# Altium schematic sheet [05] CM4_PART2.SchDoc: Compute Module 4 (Part #2)
size B; Engineer: M. Folejewski; DocumentNumber: 5; SheetNumber: 5; SheetTotal: 17; PageSize: B; Designators: 100-199
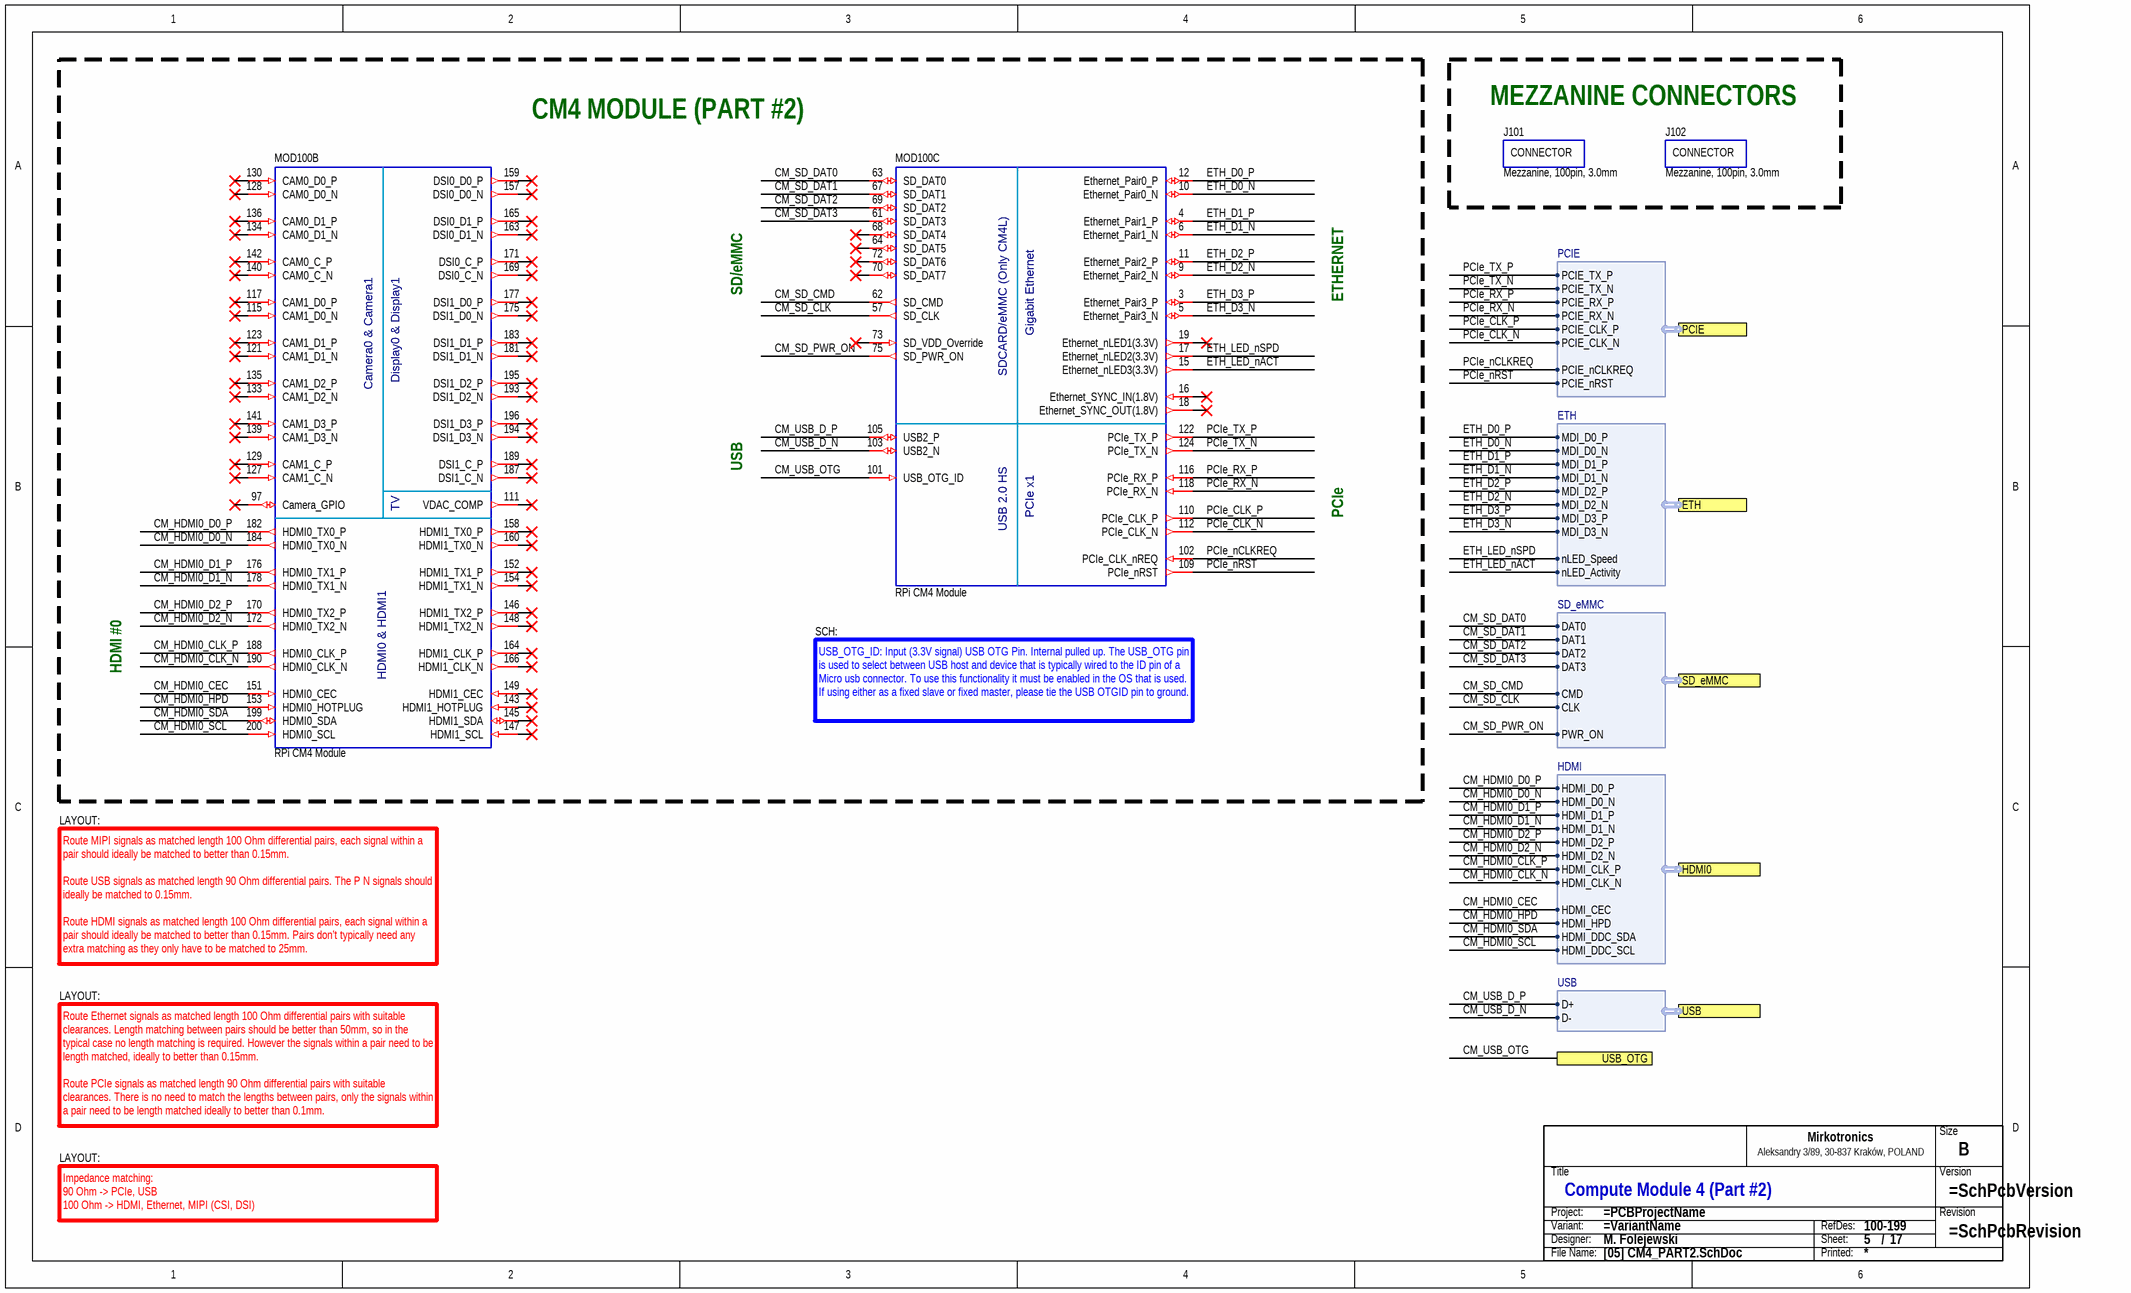
[diagram p0: [05] CM4_PART2.SchDoc]

## Parts
J101  Mezzanine, 100pin, 3.0mm  [PCB_BLANK_COMP_SMD]
J102  Mezzanine, 100pin, 3.0mm  [PCB_BLANK_COMP_SMD]
MOD100  RPi CM4 Module  [MOD_RPI_CM4_SOCKET_P40_C300]  (parts B,C of 4)
TB?  Title block  (value not drawn)  (graphical)

## Ports
ETH (harness ETH), HDMI0 (harness HDMI), PCIE (harness PCIE), SD_eMMC (harness SD_eMMC), USB (harness USB), USB_OTG

## Harnesses
SD_eMMC: DAT0, DAT1, DAT2, DAT3, CMD, CLK, PWR_ON
USB: D+, D-
ETH: MDI_D0_P, MDI_D0_N, MDI_D1_P, MDI_D1_N, MDI_D2_P, MDI_D2_N, MDI_D3_P, MDI_D3_N, nLED_Speed, nLED_Activity
PCIE: PCIE_TX_P, PCIE_TX_N, PCIE_RX_P, PCIE_RX_N, PCIE_CLK_P, PCIE_CLK_N, PCIE_nCLKREQ, PCIE_nRST
HDMI: HDMI_D0_P, HDMI_D0_N, HDMI_D1_P, HDMI_D1_N, HDMI_CEC, HDMI_DDC_SDA, HDMI_D2_P, HDMI_D2_N, HDMI_CLK_P, HDMI_CLK_N, HDMI_DDC_SCL, HDMI_HPD

## Nets
CM_HDMI0_CEC: MOD100.151(HDMI0_CEC) ; port HDMI0.HDMI_CEC
CM_HDMI0_CLK_N: MOD100.190(HDMI0_CLK_N) ; port HDMI0.HDMI_CLK_N
CM_HDMI0_CLK_P: MOD100.188(HDMI0_CLK_P) ; port HDMI0.HDMI_CLK_P
CM_HDMI0_D0_N: MOD100.184(HDMI0_TX0_N) ; port HDMI0.HDMI_D0_N
CM_HDMI0_D0_P: MOD100.182(HDMI0_TX0_P) ; port HDMI0.HDMI_D0_P
CM_HDMI0_D1_N: MOD100.178(HDMI0_TX1_N) ; port HDMI0.HDMI_D1_N
CM_HDMI0_D1_P: MOD100.176(HDMI0_TX1_P) ; port HDMI0.HDMI_D1_P
CM_HDMI0_D2_N: MOD100.172(HDMI0_TX2_N) ; port HDMI0.HDMI_D2_N
CM_HDMI0_D2_P: MOD100.170(HDMI0_TX2_P) ; port HDMI0.HDMI_D2_P
CM_HDMI0_HPD: MOD100.153(HDMI0_HOTPLUG) ; port HDMI0.HDMI_HPD
CM_HDMI0_SCL: MOD100.200(HDMI0_SCL) ; port HDMI0.HDMI_DDC_SCL
CM_HDMI0_SDA: MOD100.199(HDMI0_SDA) ; port HDMI0.HDMI_DDC_SDA
CM_SD_CLK: MOD100.57(SD_CLK) ; port SD_eMMC.CLK
CM_SD_CMD: MOD100.62(SD_CMD) ; port SD_eMMC.CMD
CM_SD_DAT0: MOD100.63(SD_DAT0) ; port SD_eMMC.DAT0
CM_SD_DAT1: MOD100.67(SD_DAT1) ; port SD_eMMC.DAT1
CM_SD_DAT2: MOD100.69(SD_DAT2) ; port SD_eMMC.DAT2
CM_SD_DAT3: MOD100.61(SD_DAT3) ; port SD_eMMC.DAT3
CM_SD_PWR_ON: MOD100.75(SD_PWR_ON) ; port SD_eMMC.PWR_ON
CM_USB_D_N: MOD100.103(USB2_N) ; port USB.D-
CM_USB_D_P: MOD100.105(USB2_P) ; port USB.D+
CM_USB_OTG: MOD100.101(USB_OTG_ID) ; port USB_OTG
ETH_D0_N: MOD100.10(Ethernet_Pair0_N) ; port ETH.MDI_D0_N
ETH_D0_P: MOD100.12(Ethernet_Pair0_P) ; port ETH.MDI_D0_P
ETH_D1_N: MOD100.6(Ethernet_Pair1_N) ; port ETH.MDI_D1_N
ETH_D1_P: MOD100.4(Ethernet_Pair1_P) ; port ETH.MDI_D1_P
ETH_D2_N: MOD100.9(Ethernet_Pair2_N) ; port ETH.MDI_D2_N
ETH_D2_P: MOD100.11(Ethernet_Pair2_P) ; port ETH.MDI_D2_P
ETH_D3_N: MOD100.5(Ethernet_Pair3_N) ; port ETH.MDI_D3_N
ETH_D3_P: MOD100.3(Ethernet_Pair3_P) ; port ETH.MDI_D3_P
ETH_LED_nACT: MOD100.15(Ethernet_nLED3(3.3V)) ; port ETH.nLED_Activity
ETH_LED_nSPD: MOD100.17(Ethernet_nLED2(3.3V)) ; port ETH.nLED_Speed
PCIe_CLK_N: MOD100.112(PCIe_CLK_N) ; port PCIE.PCIE_CLK_N
PCIe_CLK_P: MOD100.110(PCIe_CLK_P) ; port PCIE.PCIE_CLK_P
PCIe_nCLKREQ: MOD100.102(PCIe_CLK_nREQ) ; port PCIE.PCIE_nCLKREQ
PCIe_nRST: MOD100.109(PCIe_nRST) ; port PCIE.PCIE_nRST
PCIe_RX_N: MOD100.118(PCIe_RX_N) ; port PCIE.PCIE_RX_N
PCIe_RX_P: MOD100.116(PCIe_RX_P) ; port PCIE.PCIE_RX_P
PCIe_TX_N: MOD100.124(PCIe_TX_N) ; port PCIE.PCIE_TX_N
PCIe_TX_P: MOD100.122(PCIe_TX_P) ; port PCIE.PCIE_TX_P

Not connected (* = marked no-connect by the designer): MOD100 16(Ethernet_SYNC_IN(1.8V))* 18(Ethernet_SYNC_OUT(1.8V))* 19(Ethernet_nLED1(3.3V))* 64(SD_DAT5)* 68(SD_DAT4)* 70(SD_DAT7)* 72(SD_DAT6)* 73(SD_VDD_Override)* 97(Camera_GPIO)* 111(VDAC_COMP)* 115(CAM1_D0_N)* 117(CAM1_D0_P)* 121(CAM1_D1_N)* 123(CAM1_D1_P)* 127(CAM1_C_N)* 128(CAM0_D0_N)* 129(CAM1_C_P)* 130(CAM0_D0_P)* 133(CAM1_D2_N)* 134(CAM0_D1_N)* 135(CAM1_D2_P)* 136(CAM0_D1_P)* 139(CAM1_D3_N)* 140(CAM0_C_N)* 141(CAM1_D3_P)* 142(CAM0_C_P)* 143(HDMI1_HOTPLUG)* 145(HDMI1_SDA)* 146(HDMI1_TX2_P)* 147(HDMI1_SCL)* 148(HDMI1_TX2_N)* 149(HDMI1_CEC)* 152(HDMI1_TX1_P)* 154(HDMI1_TX1_N)* 157(DSI0_D0_N)* 158(HDMI1_TX0_P)* 159(DSI0_D0_P)* 160(HDMI1_TX0_N)* 163(DSI0_D1_N)* 164(HDMI1_CLK_P)* 165(DSI0_D1_P)* 166(HDMI1_CLK_N)* 169(DSI0_C_N)* 171(DSI0_C_P)* 175(DSI1_D0_N)* 177(DSI1_D0_P)* 181(DSI1_D1_N)* 183(DSI1_D1_P)* 187(DSI1_C_N)* 189(DSI1_C_P)* 193(DSI1_D2_N)* 194(DSI1_D3_N)* 195(DSI1_D2_P)* 196(DSI1_D3_P)*

## Notes on the sheet
- CM4 MODULE (PART #2)
- MEZZANINE CONNECTORS
- SD/eMMC
- ETHERNET
- USB
- PCIe
- SCH:
- HDMI #0
- USB_OTG_ID: Input (3.3V signal) USB OTG Pin. Internal pulled up. The USB_OTG pin is used to select between USB host and device that is typically wired to the ID pin of a Micro usb connector. To use this functionality it must be enabled in the OS that is used. If using either as a fixed slave or fixed master, please tie the USB OTGID pin to ground.
- LAYOUT:
- Route MIPI signals as matched length 100 Ohm differential pairs, each signal within a pair should ideally be matched to better than 0.15mm.
  Route USB signals as matched length 90 Ohm differential pairs. The P N signals should ideally be matched to 0.15mm.
  Route HDMI signals as matched length 100 Ohm differential pairs, each signal within a pair should ideally be matched to better than 0.15mm. Pairs don’t typically need any extra matching as they only have to be matched to 25mm.
- Route Ethernet signals as matched length 100 Ohm differential pairs with suitable clearances. Length matching between pairs should be better than 50mm, so in the typical case no length matching is required. However the signals within a pair need to be length matched, ideally to better than 0.15mm.
  Route PCIe signals as matched length 90 Ohm differential pairs with suitable clearances. There is no need to match the lengths between pairs, only the signals within a pair need to be length matched ideally to better than 0.1mm.
- Impedance matching:
  90 Ohm -> PCIe, USB
  100 Ohm -> HDMI, Ethernet, MIPI (CSI, DSI)
- (in symbol BOM_CON) CONNECTOR
- (in symbol MOD_RPI_CM4_VAR2, part B) Display0 & Display1; Camera0 & Camera1; TV; HDMI0 & HDMI1
- (in symbol MOD_RPI_CM4_VAR2, part C) Gigabit Ethernet; SDCARD/eMMC (Only CM4L); PCIe x1; USB 2.0 HS
- (in symbol SCH_TITLE_BLOCK_MIRKOTRONICS_V2) Size; Mirkotronics; Aleksandry 3/89, 30-837 Kraków, POLAND; Title; Version; Project:; Revision; Variant:; RefDes:; Designer:; Sheet:; /; File Name:; Printed:

## Library data of the parts
J101 J102 = BOM_CON: BOM list; Connector;; Manufacturer: Hirose; MPN: DF40HC(3.0)-100DS-0.4V; Component Subtype: Microminiature; Package (Case): SMD; Value: Mezzanine, 100pin, 3.0mm; Component Type: Connector; Mounting Type: SMD; Supplier: ?; Supplier 1: LCSC; Supplier Part Number 1: C424649
MOD100 = MOD_RPI_CM4_VAR2: PCB Module; RPi Compute Module 4;; Manufacturer: Raspberry Pi Foundation; Component Subtype: Raspberry Pi CM4; Value: RPi CM4 Module; MPN: CM4 Module; Component Type: PCB Module; Mounting Type: -; Supplier: ?; Supplier 1: Farnell
TB? = SCH_TITLE_BLOCK_MIRKOTRONICS_V2: Component Type: Title block; Manufacturer: -; Mounting Type: Non component; MPN: -; Operating Temperature: -; Package: -; Specification: Title block; Value: Title block; Replacement: -; System: ?